# EAGLE design isl2 (EAGLE 7.5.0)
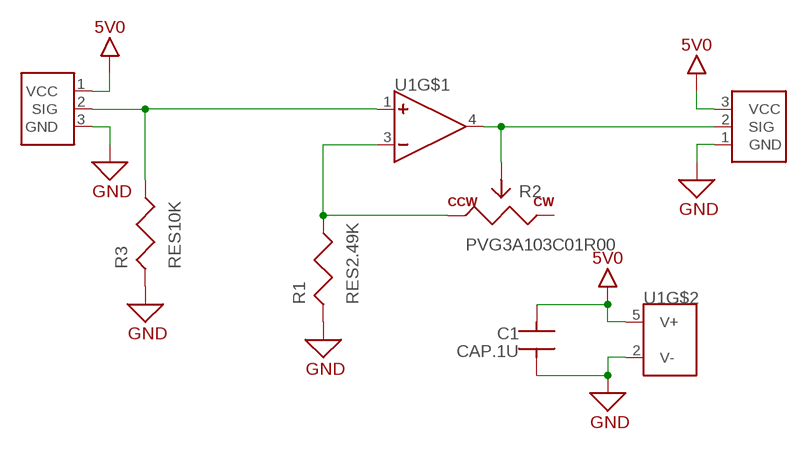
[diagram p0: schematic, sheet 1]

## Parts
C1  CAP.1U  [SMT0603]
J1  BITSNAPINPUT  [BITSNAP_INPUT_MALE]
J2  BITSNAPOUTPUT  [BITSNAP_OUTPUT_FEMALE]
R1  RES2.49K  [SMT0603]
R2  PVG3A103C01R00  [PVG3A]
R3  RES10K  [SMT0603]
U1  LMV321  [SOT23-5]

## Nets
5V0: C1.2 J1.1(VCC) J2.3(VCC) U1.5(V+)
GND: C1.1 J1.3(GND) J2.1(GND) R1.1 R3.1 U1.2(V-)
N$1: J1.2(SIG) R3.2 U1.1(IN+)
N$2: R1.2 R2.1(CCW) U1.3(IN-)
N$4: J2.2(SIG) R2.2(WIPER) U1.4(OUT)
Unconnected: R2.3(CW)

## Library data of the parts
C1 = Common:CAP.1U; MFR: Murata; MPN: GRM188R71H104KA93D; VND: DigiKey; VPN: 490-1519-6-ND
J1 J2 = BitLab:BITSNAP
R1 = Common:RES2.49K
R2 = BitLab:PVG3A103C01R00
R3 = Common:RES10K; MFR: Panasonic; MPN: ERJ-3EKF1002V; VND: DigiKey; VPN: P10.0KHDKR-ND
U1 = BitLab:LMV321

## Board
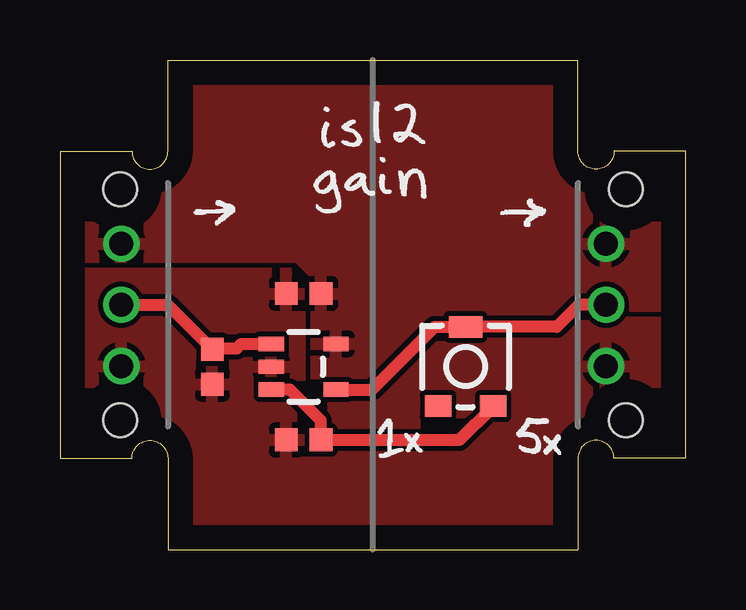
[diagram p1: board, top side]
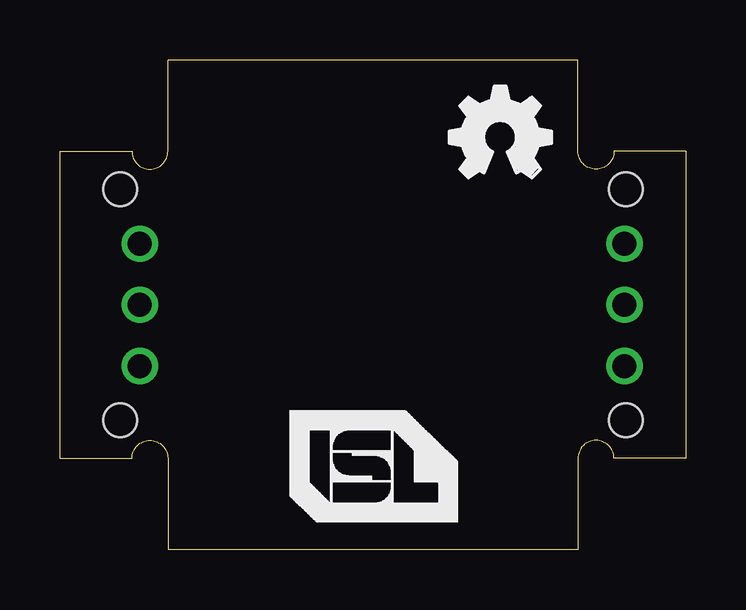
[diagram p2: board, bottom side, seen from below]

Size 26.1 x 20.4 mm. Coordinates in mm from the lower left corner, seen from the top.
Outline: 4.5,20.4 21.6,20.4
Outline: 4.5,0 21.6,0
Copper layers (1*16): Top 0.035mm / dielectric 1.5mm / Bottom 0.035mm
Design rules "default": minimum track width 10mil, minimum drill 24mil, track to track 8mil, track to pad 8mil, pad to pad 8mil, via to via 8mil, smd to smd 8mil, copper to edge 40mil, drill to drill 8mil, minimum pad ring 10mil, minimum via ring 8mil, stop-mask expansion 4mil, vias tented up to drill 0mil, thermal gap 10mil

### Footprints (pad centres in the part's own frame; a part is rotated, then mirrored left to right if it is on the bottom)
SMT0603 = smd 0.95 x 0.95: 1 -0.725,0; 2 0.725,0
BITSNAP_INPUT_MALE = drill 1: 1 -2.55,2.56; 2 0,2.56; 3 2.55,2.56 | hole 1.4: -4.82,2.5; 4.82,2.5
BITSNAP_OUTPUT_FEMALE = drill 1: 1 -2.55,3.33; 2 0,3.33; 3 2.55,3.33 | hole 1.4: -4.82,2.5; 4.82,2.5
PVG3A = smd 1.1 x 0.9: 1 1.15,-1.65; 3 -1.15,-1.65 | smd 1.4 x 0.9: 2 0,1.65
SOT23-5 = smd 0.6 x 1.05: 1 -0.95,-1.35; 2 0,-1.35; 3 0.95,-1.35; 4 0.95,1.35; 5 -0.95,1.35

### Placement (x,y rotation side)
C1  10.16,10.67 0 top
J1  0,10.2 270 top
J2  26.1,10.2 90 top
R1  10.16,4.57 0 top
R2  16.91,7.63 0 top
R3  6.35,7.62 90 top
U1  10.16,7.62 270 top
U$8  [ISL2_LABEL]  12.95,16.26 0 top
U$10  [OSHW_FILLX150_NOTEXT]  10.7,15.5 90 top
U$11  [ISL_LOGO]  16.6,1 0 bottom
U$12  [1X_LABEL]  14.22,4.57 0 top
U$13  [ARROW]  6.41,14.07 0 top
U$14  [ARROW2]  19.31,14.07 0 top
U$15  [5X_LABEL]  20.07,4.57 0 top

### Tracks (layer width: path | path; a pad name or v marks a point on that pad's centre or on a via)
5V0
  pour Top: 0,20.32 0,12.19 9.91,12.19 10.67,11.43 10.67,6.6 12.95,6.6 15.75,9.4 20.57,9.4 21.34,10.16 26.16,10.16 26.16,20.32
GND
  pour Top (rank 2): 0,0 0,20.4 26.1,20.4 26.1,0
N$1
  Top 0.508: J1.2 4.5,10.2 R3.2 6.39,8.38 7.37,8.38 7.55,8.57 U1.1
N$2
  Top 0.508: R2.1 16.65,4.57 R1.2 10.88,5.37 9.59,6.67 U1.3
N$4
  Top 0.508: U1.4 13.02,6.67 15.63,9.28 R2.2 20.71,9.28 21.63,10.2 J2.2